# EAGLE design Grove - Rotary Angle Sensor v1.2 (EAGLE 6.4)
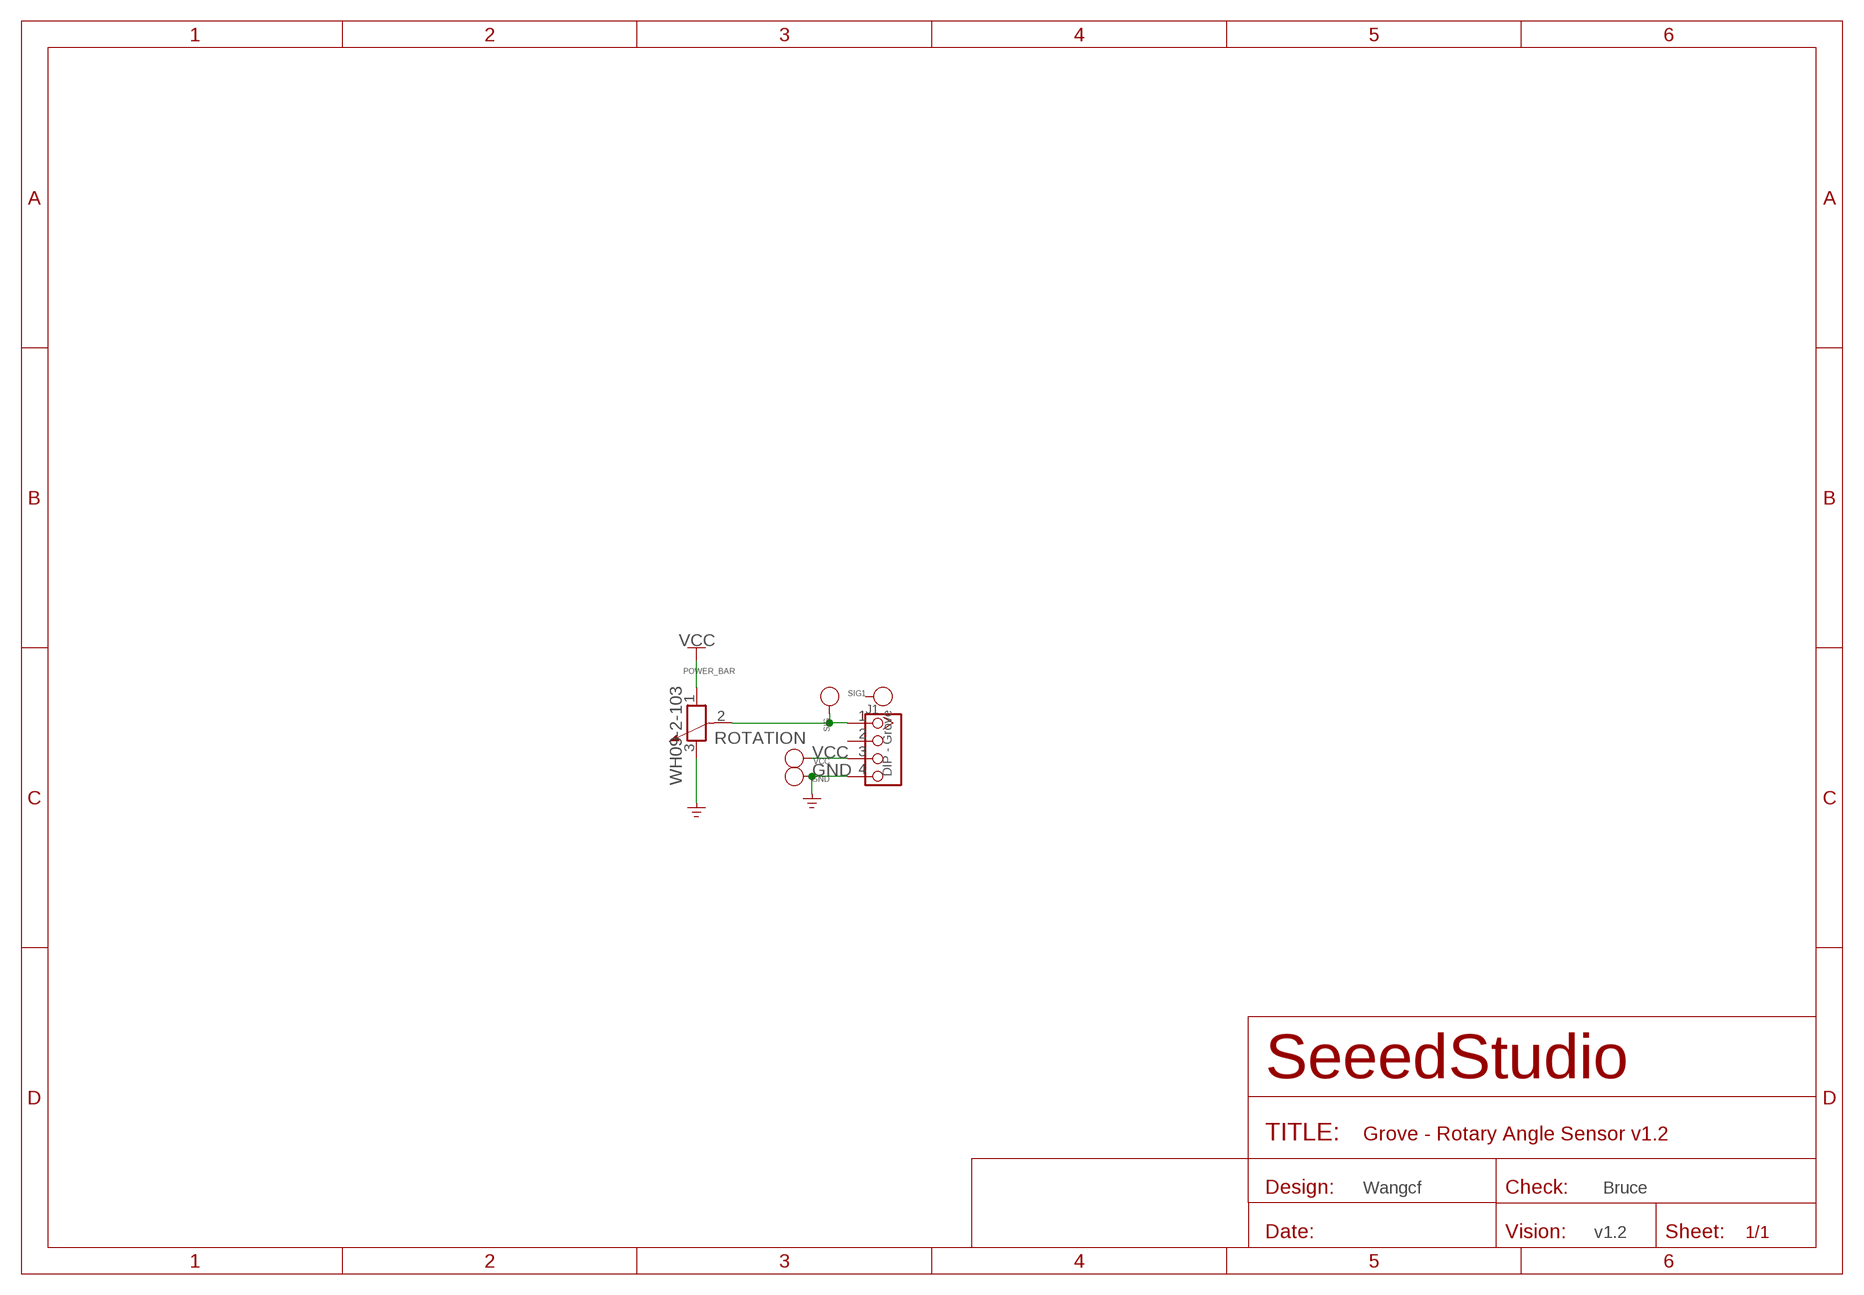
[diagram p0: schematic, sheet 1]

## Parts
GND  PAD-TEST-POINT'4545'  [TP_4545]
J1  DIP - Grove  TWIG-4P-2.0-2.0  [4P-2.0]
ROTATION  WH09-2-103  R-POTENTIOMETER'WH09-2'  [3P-SQUA-11X9.8X12H]
SIG  PAD-TEST-POINT'4545'  [TP_4545]
SIG1  PAD-TEST-POINT'4545'  [TP_4545]
VCC  PAD-TEST-POINT'4545'  [TP_4545]

## Nets
GND: GND.T J1.4 ROTATION.3
N$2: J1.1 ROTATION.2 SIG.T
VCC: J1.3 ROTATION.1 VCC.T ; supply symbol labelled POWER_BAR
Unconnected: J1.2 SIG1.T

## Notes on the sheet
- Wangcf | Bruce
- v1.2

## Library data of the parts
GND SIG SIG1 VCC = Discrete:PAD-TEST-POINT; PARTNO: DNP
J1 = Connector :TWIG-4P-2.0
ROTATION = Discrete:R-POTENTIOMETER*: Potentiometer

## Board
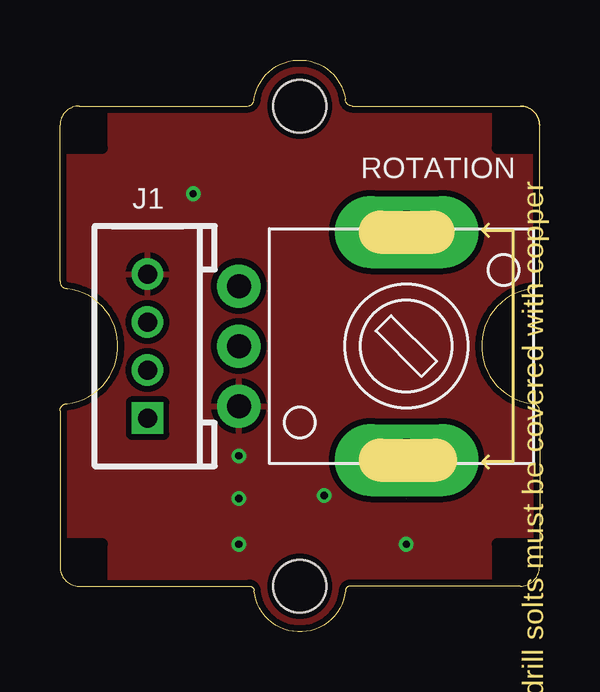
[diagram p1: board, top side]
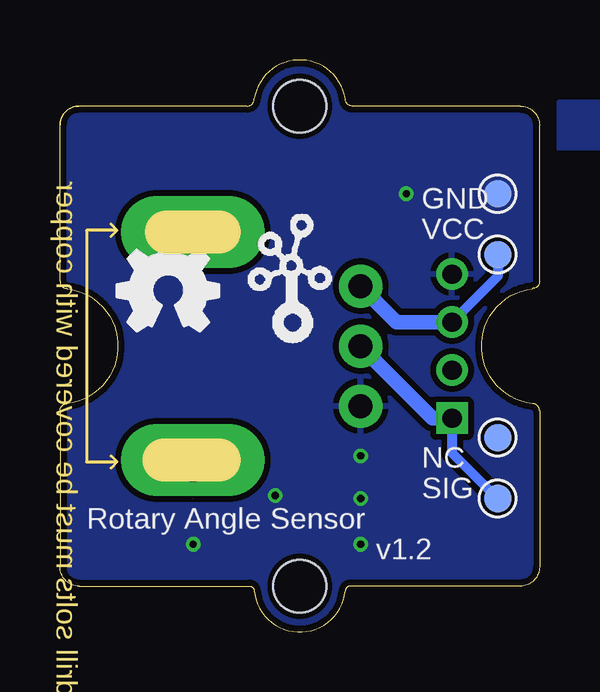
[diagram p2: board, bottom side, seen from below]

Size 20 x 23.83 mm. Coordinates in mm from the lower left corner, seen from the top.
Copper layers (1*16): Top 0.035mm / dielectric 1.5mm / Bottom 0.035mm
Design rules "SeeedStudio_DRU_no_angle_20130527 *": minimum track width 6mil, minimum drill 12mil, track to track 6mil, track to pad 6mil, pad to pad 6mil, via to via 6mil, smd to smd 0mil, copper to edge 10mil, drill to drill 10mil, minimum pad ring 10mil, minimum via ring 6mil, stop-mask expansion 2mil, vias tented up to drill 25mil, thermal gap 10mil

### Footprints (pad centres in the part's own frame; a part is rotated, then mirrored left to right if it is on the bottom)
TP_4545 = smd 1.143 x 1.143: T 0,0
4P-2.0 = drill 0.8 pad 1.27 square: 1 -3,0 | drill 0.8 pad 1.27: 2 -1,0; 3 1,0; 4 3,0
3P-SQUA-11X9.8X12H = drill 1 pad 1.8: 1 0,2.5; 2 0,0; 3 0,-2.5 | drill 1.8 pad 3 long: P1 7,4.75; P2 7,-4.75
1U-DIM-W/-DRILL = hole 2.2: 0,-10; 0,10

### Placement (x,y rotation side)
GND  1.74,18.26 0 bottom
J1  3.65,11.91 90 top
ROTATION  7.46,11.91 0 top
SIG  1.74,5.56 0 bottom
SIG1  1.74,8.1 0 bottom
U$5  [1U-DIM-W/-DRILL]  10,11.91 0 top
U$6  [OSHW_FILLX150_NOTEXT]  17.62,12.54 0 bottom
U$9  [TWIGLOGO_SMALL]  12.54,11.91 0 bottom
VCC  1.74,15.72 0 bottom

### Tracks (layer width: path | path; a pad name or v marks a point on that pad's centre or on a via)
GND  (via drill 0.3 pad 0.38)  (1 unrouted)
  other vias: 14.45,3.65 7.46,3.65 7.46,5.56 7.46,7.34 11.02,5.69 5.55,18.26
  pour Bottom: -2.7,22.07 -0.79,22.07 -0.79,20.16 -2.7,20.16
  pour Bottom (isolate 0.254): -0.16,-0.16 20.16,-0.16 20.16,23.97 -0.16,23.97
  pour Top (isolate 0.254): -0.16,-0.16 20.16,-0.16 20.16,23.97 -0.16,23.97
N$2
  Bottom 0.406: J1.1 3.65,7.46 SIG.T
  Bottom 0.61: J1.1 4.46,8.91 ROTATION.2
VCC
  Bottom 0.406: VCC.T 1.74,14.81 J1.3
  Bottom 0.61: J1.3 5.96,12.91 ROTATION.1

### Text on the board
bPlace: GND | VCC | NC | SIG | Rotary Angle Sensor | v1.2